# EAGLE design Tiny_Programmer (EAGLE 7.4.0)
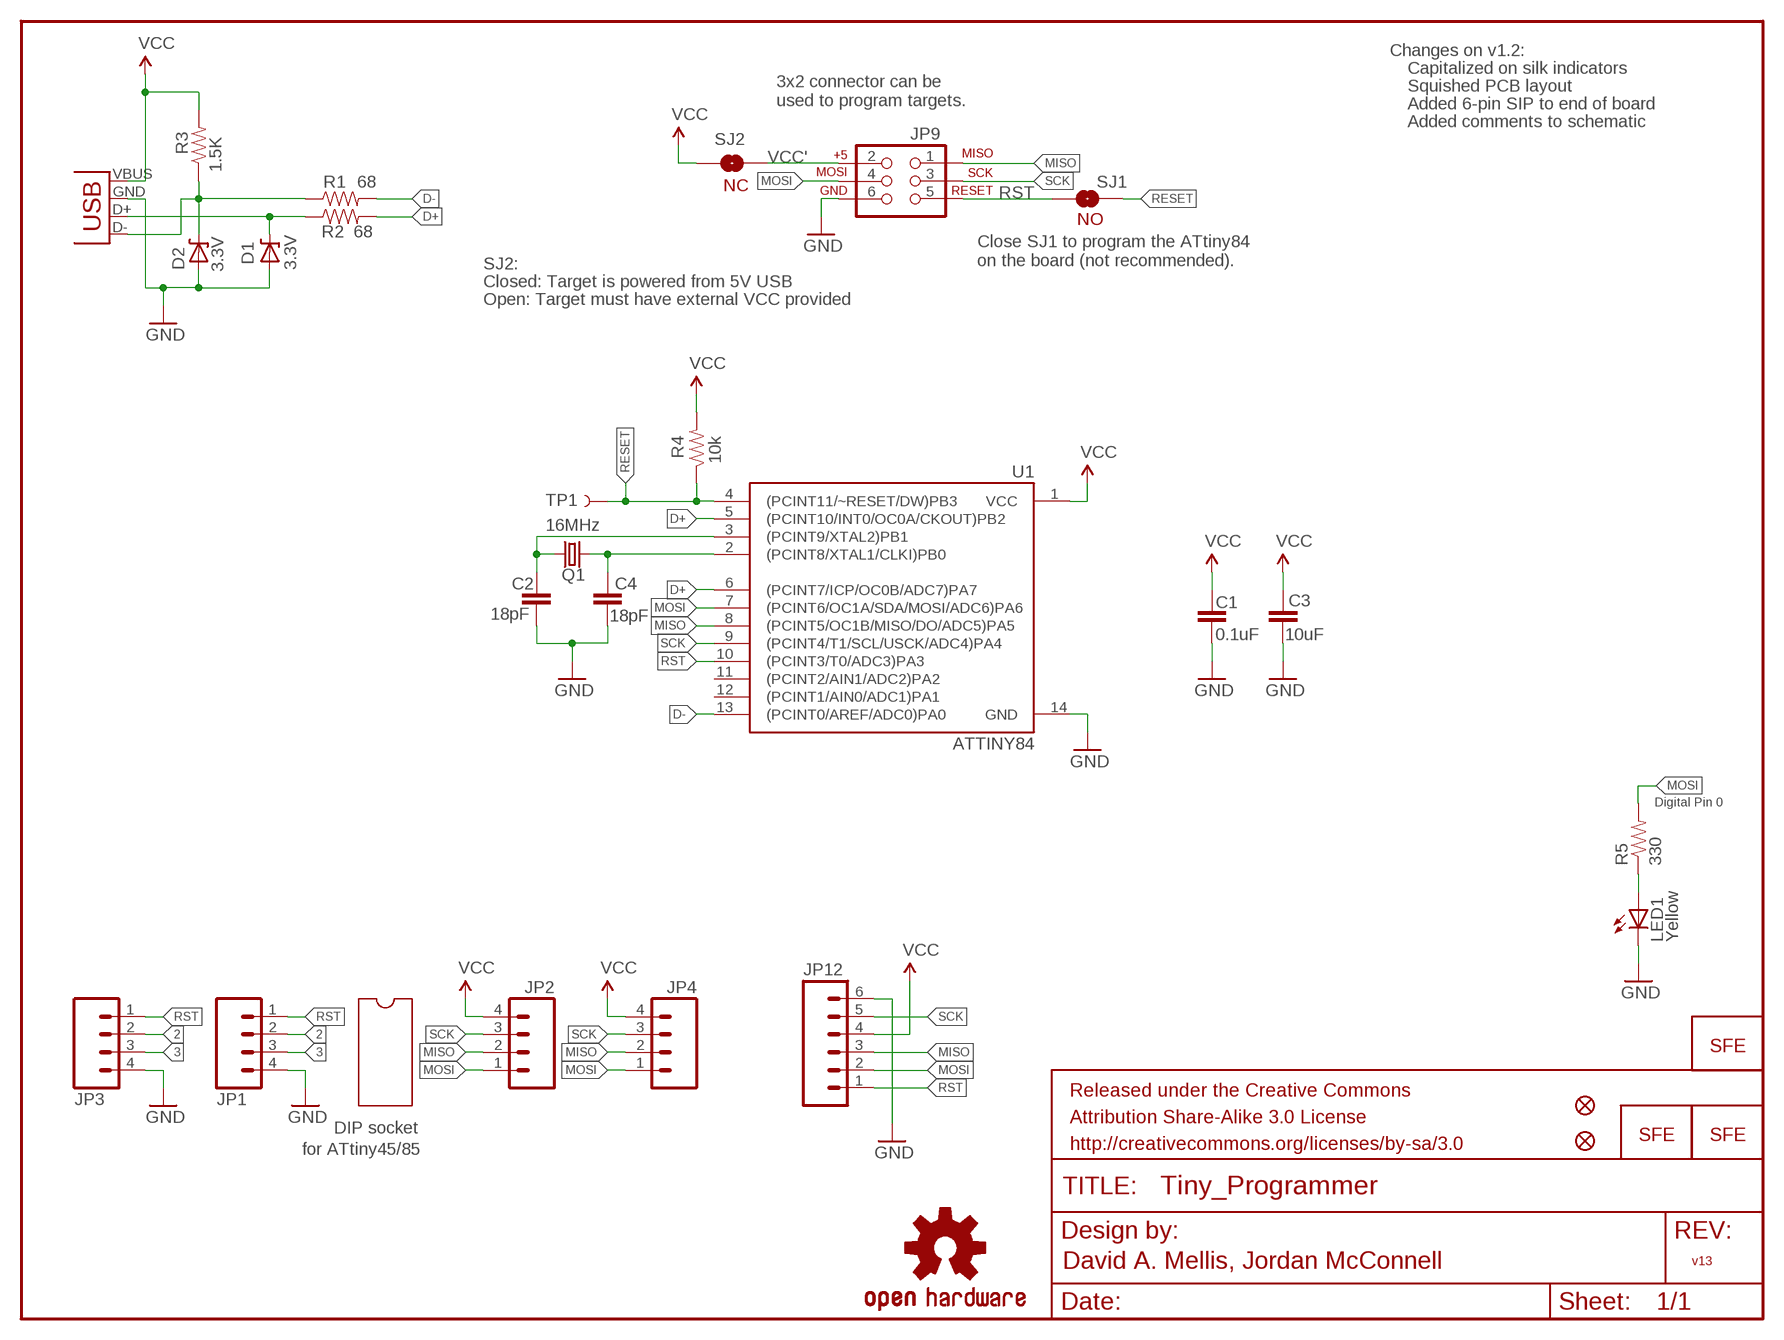
[diagram p0: schematic, sheet 1]

## Parts
C1  0.1uF  CAP0402-CAP  [0402-CAP]
C2  18pF  CAP0402-CAP  [0402-CAP]
C3  10uF  CAP0402-CAP  [0402-CAP]
C4  18pF  CAP0402-CAP  [0402-CAP]
D1  3.3V  DIODE-ZENER-BZT52  [SOD-323]
D2  3.3V  DIODE-ZENER-BZT52  [SOD-323]
FRAME1  FRAME-LETTER  [CREATIVE_COMMONS]
JP1  M04PTH  [1X04]
JP2  M04PTH  [1X04]
JP3  M04SMD_STRAIGHT_COMBO  [1X04_SMD_STRAIGHT_COMBO]
JP4  M04SMD_STRAIGHT_COMBO  [1X04_SMD_STRAIGHT_COMBO]
JP5  LOGO-SFENW2  [SFE-NEW-WEB]
JP6  LOGO-SFESK  [SFE-LOGO-FLAME]
JP7  FIDUCIALUFIDUCIAL  [MICRO-FIDUCIAL]
JP8  FIDUCIALUFIDUCIAL  [MICRO-FIDUCIAL]
JP9  AVR_SPI_PRG_6PTH  [2X3]
JP11  LOGO-SFESK  [SFE-LOGO-FLAME]
JP12  M06SIP  [1X06]
LED1  Yellow  LED0603  [LED-0603]
Q1  16MHz  CRYSTAL5X3  [CRYSTAL-SMD-5X3]
R1  68  RESISTOR0402-RES  [0402-RES]
R2  68  RESISTOR0402-RES  [0402-RES]
R3  1.5K  RESISTOR0402-RES  [0402-RES]
R4  10k  RESISTOR0402-RES  [0402-RES]
R5  330  RESISTOR0402-RES  [0402-RES]
SJ1  SOLDERJUMPERNO  [SJ_2S-NO]
SJ2  NC  SOLDERJUMPERNC  [SJ_2S]
TP1  TEST-POINT3  [PAD.03X.03]
U1  ATTINY84  [SO14]
U$1  OSHW-LOGOS  [OSHW-LOGO-S]
X1  USB-A-H  [USB-A-H]

## Nets
2: JP1.2 JP3.2
3: JP1.3 JP3.3
D+: R2.2 U1.5((PCINT10/INT0/OC0A/CKOUT)PB2) U1.6((PCINT7/ICP/OC0B/ADC7)PA7)
D-: R1.2 U1.13((PCINT0/AREF/ADC0)PA0)
GND: C1.2 C2.2 C3.2 C4.2 D1.2(A) D2.2(A) JP1.4 JP3.4 JP9.6 JP12.6 LED1.C U1.14(GND) X1.GND(VBUS)
MISO: JP2.2 JP4.2 JP9.1 JP12.3 U1.8((PCINT5/OC1B/MISO/DO/ADC5)PA5)
MOSI: JP2.1 JP4.1 JP9.4 JP12.2 R5.2 U1.7((PCINT6/OC1A/SDA/MOSI/ADC6)PA6)
N$1: D2.1(C) R1.1 R3.1 X1.D-(D+)
N$2: D1.1(C) R2.1 X1.D+(D-)
N$3: C2.1 Q1.3 U1.3((PCINT9/XTAL2)PB1)
N$4: C4.1 Q1.1 U1.2((PCINT8/XTAL1/CLKI)PB0)
N$5: LED1.A R5.1
RESET: R4.1 SJ1.1 TP1.P$1 U1.4((PCINT11/~RESET/DW)PB3)
RST: JP1.1 JP3.1 JP9.5 JP12.1 SJ1.2 U1.10((PCINT3/T0/ADC3)PA3)
SCK: JP2.3 JP4.3 JP9.3 JP12.5 U1.9((PCINT4/T1/SCL/USCK/ADC4)PA4)
VCC: C1.1 C3.1 JP2.4 JP4.4 JP12.4 R3.2 R4.2 SJ2.1 U1.1(VCC) X1.VBUS(GND)
VCC': JP9.2 SJ2.2
Unconnected: U1.11((PCINT2/AIN1/ADC2)PA2) U1.12((PCINT1/AIN0/ADC1)PA1)

## Notes on the sheet
- Changes on v1.2:
- Capitalized on silk indicators
- Squished PCB layout
- 3x2 connector can be
  used to program targets.
- Added 6-pin SIP to end of board
- Added comments to schematic
- NC
- NO
- Close SJ1 to program the ATtiny84
  on the board (not recommended).
- SJ2:
- Closed: Target is powered from 5V USB
- Open: Target must have external VCC provided
- Digital Pin 0
- DIP socket
- for ATtiny45/85
- v13
- David A. Mellis, Jordan McConnell

## Library data of the parts
C1-C4 = SparkFun-Passives:CAP: Capacitor Standard 0603 ceramic capacitor, and 0.1" leaded capacitor.
D1 D2 = SparkFun-DiscreteSemi:DIODE-ZENER: Zener Diode Production Part - 8199 3.4V Zener Voltage
FRAME1 = SparkFun-Aesthetics:FRAME-LETTER: Schematic Frame Standard 8.5x11 US Letter frame
JP1-JP4 = SparkFun-Connectors:M04: Header 4 Standard 4-pin 0.1" header. Use with straight break away headers (SKU : PRT-00116), right angle break away headers (PRT-00553), swiss pins (PRT-00743), machine pins (PRT-00117), and female headers (PRT-00115). Molex polarized connector foot print use with SKU : PRT-08231 with associated crimp pins and housings. 1MM SMD Version SKU: PRT-10208
JP5 JP6 JP11 = SparkFun-Aesthetics:LOGO-SFE: Spark Fun Electronics PCB Logo This is the standard Spark Fun Electronics PCB logo.
JP7 JP8 = SparkFun:FIDUCIAL: Fiducial Alignment Points Various fiducial points for machine vision alignment.
JP9 = SparkFun-Connectors:AVR_SPI_PRG_6: AVR ISP 6 Pin This is the reduced ISP connector for AVR programming. Common on Arduino. This footprint will take up less PCB space and can be used with a 10-pin to 6-pin adapter such as SKU: BOB-08508
JP12 = SparkFun-Connectors:M06: Header 6 Standard 6-pin 0.1" header. Use with straight break away headers (SKU : PRT-00116), right angle break away headers (PRT-00553), swiss pins (PRT-00743), machine pins (PRT-00117), and female headers (PRT-00115). Molex polarized connector foot print use with SKU : PRT-08094 with associated crimp pins and housings. NOTES ON THE VARIANTS LOCK and LOCK_LONGPADS... This footprint was designed to help hold the alignment of a through-hole component (i.e. 6-pin header) while soldering it into place. You may notice that each hole has been shifted either up or down by 0.005 of an inch from it's more standard position (which is a perfectly straight line). This slight alteration caused the pins (the squares in the middle) to touch the edges of the holes. Because they are alternating, it causes a "brace" to hold the component in place. 0.005 has proven to be the perfect amount of "off-center" position when using our standard breakaway headers. Although looks a little odd when you look at the bare footprint, once you have a header in there, the alteration is very hard to notice. Also,if you push a header all the way into place, it is covered up entirely on the bottom side. This idea of altering the position of holes to aid alignment will be further integrated into the Sparkfun Library for other footprints. It can help hold any component with 3 or more connection pins.
LED1 = SparkFun-LED:LED: LEDs Standard schematic elements and footprints for 5mm, 3mm, 1206, and 0603 sized LEDs. 5mm - Spark Fun Electronics SKU : COM-00529 (and others)
Q1 = SparkFun-FreqCtrl:CRYSTAL: Various standard crystals. Proven footprints. Spark Fun Electronics SKU : COM-00534
R1-R5 = SparkFun-Passives:RESISTOR: Resistor Basic schematic elements and footprints for 0603, 1206, and PTH resistors.
SJ1 SJ2 = SparkFun-Passives:SOLDERJUMPER: Solder Jumper Standard SMD solder jumper. Used to automate production. Two varients : Normally Open and Normally Closed are the same, but have different paste layers. NC will have a large amount of paste and should jumper during reflow.
TP1 = SparkFun-Passives:TEST-POINT: Bare copper test points for troubleshooting or ICT
U1 = SparkFun-DigitalIC:ATTINY84: Atmel 14-pin 2/4/8kB flash uC
U$1 = SparkFun-Aesthetics:OSHW-LOGO: Open Source Hardware Logo This logo indicates the piece of hardware it is found on incorporates a OSHW license and/or adheres to the definition of open source hardware found here: http://freedomdefined.org/OSHW
X1 = SparkFun-Connectors:USB: USB Connectors USB-B-PTH is fully proven SKU : PRT-00139 USB-miniB is fully proven SKU : PRT-00587 USB-A-PCB is untested. USB-A-H is throughly reviewed, but untested. Spark Fun Electronics SKU : PRT-00437 USB-B-SMT is throughly reviewed, but untested. Needs silkscreen touching up. USB-A-S has not been used/tested USB-MB-H has not been used/tested

## Board
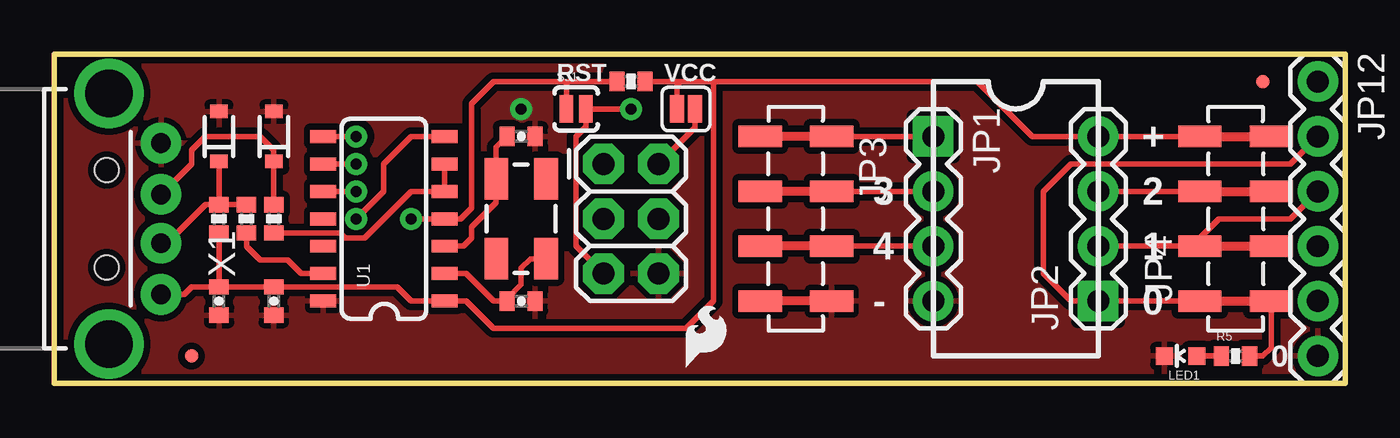
[diagram p1: board, top side]
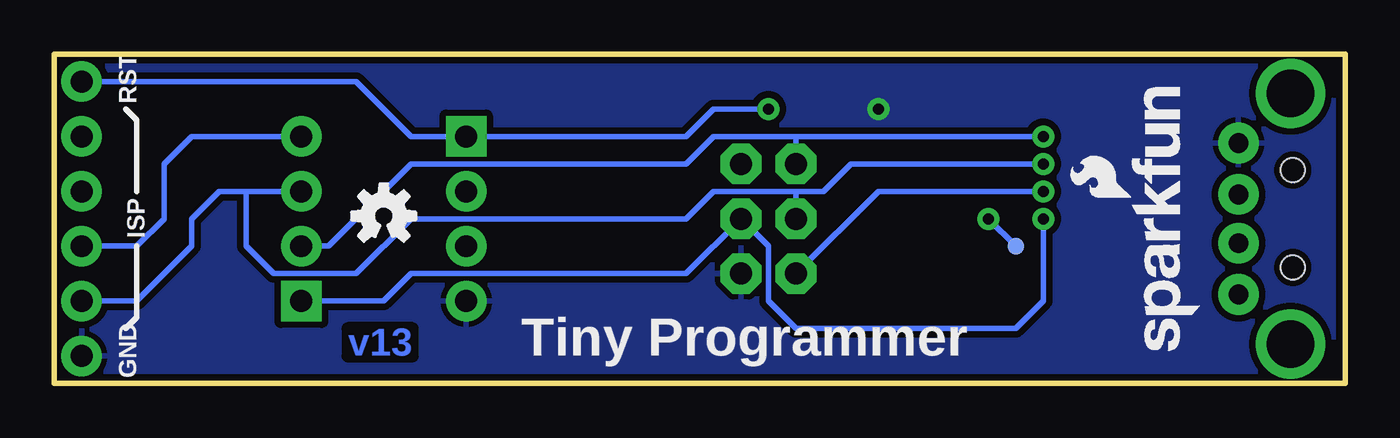
[diagram p2: board, bottom side, seen from below]

Size 59.69 x 15.24 mm. Coordinates in mm from the lower left corner, seen from the top.
Outline: 0,0 59.69,0 59.69,15.24 0,15.24 0,0
Copper layers (1*16): Top 0.035mm / dielectric 1.5mm / Bottom 0.035mm
Design rules "default": minimum track width 8mil, minimum drill 20mil, track to track 8mil, track to pad 8mil, pad to pad 8mil, via to via 8mil, smd to smd 8mil, copper to edge 8mil, drill to drill 8mil, minimum pad ring 12mil, minimum via ring 10mil, stop-mask expansion 4mil, vias tented up to drill 20mil, thermal gap 10mil

### Footprints (pad centres in the part's own frame; a part is rotated, then mirrored left to right if it is on the bottom)
0402-CAP = smd 0.7 x 0.9: 1 -0.65,0; 2 0.65,0
SOD-323 = smd 0.63 x 0.83: 1 -1.15,0; 2 1.15,0
1X04 = drill 1.016 pad 1.88 square: 1 0,0 | drill 1.016 pad 1.88: 2 2.54,0; 3 5.08,0; 4 7.62,0
1X04_SMD_STRAIGHT_COMBO = smd 1 x 2: 1 0,-1.65; 1-2 0,1.65; 2 2.54,1.65; 2-2 2.54,-1.65; 3 5.08,-1.65; 3-2 5.08,1.65; 4 7.62,1.65; 4-2 7.62,-1.65
MICRO-FIDUCIAL = smd 0.635 x 0.635: 1 0,0
2X3 = drill 1.016 pad 1.88 octagon: 1 0,0; 2 0,2.54; 3 2.54,0; 4 2.54,2.54; 5 5.08,0; 6 5.08,2.54
1X06 = drill 1.016 pad 1.88: 1 0,0; 2 2.54,0; 3 5.08,0; 4 7.62,0; 5 10.16,0; 6 12.7,0
LED-0603 = smd 0.8 x 0.8: A 0,-0.75; C 0,0.75
CRYSTAL-SMD-5X3 = smd 1.9 x 1.1: 1 -1.85,-1.15; 2 1.85,-1.15; 3 1.85,1.15; 4 -1.85,1.15
0402-RES = smd 0.7 x 0.9: 1 -0.65,0; 2 0.65,0
SJ_2S-NO = smd 0.635 x 1.27: 1 -0.45,0; 2 0.45,0
SJ_2S = smd 0.635 x 1.27: 1 -0.412,0; 2 0.412,0
PAD.03X.03 = smd 0.762 x 0.762: P$1 0,0
SO14 = smd 0.6 x 1.2: 1 -3.81,-2.8; 2 -2.54,-2.8; 3 -1.27,-2.8; 4 0,-2.8; 5 1.27,-2.8; 6 2.54,-2.8; 7 3.81,-2.8; 8 3.81,2.8; 9 2.54,2.8; 10 1.27,2.8; 11 0,2.8; 12 -1.27,2.8; 13 -2.54,2.8; 14 -3.81,2.8
USB-A-H = drill 0.914 pad 1.88: D+ 2.4,1.127; D- 2.4,-1.127; GND 2.4,3.5; VBUS 2.4,-3.5 | drill 2.2: GND2 0,-5.8; GND3 0,5.8 | hole 1.1: -0.1,2.25; -0.1,-2.25

### Placement (x,y rotation side)
C1  7.62,3.81 270 top
C2  21.59,11.43 0 top
C3  10.16,3.81 270 top
C4  21.59,3.81 0 top
D1  10.16,11.43 90 top
D2  7.62,11.43 90 top
FRAME1  6.35,-10.16 0 top  (outside the outline)
JP1  40.64,11.43 270 top
JP2  48.26,3.81 90 top
JP3  34.29,11.43 270 top
JP4  54.61,3.81 90 top
JP5  6.73,1.52 90 bottom
JP6  29.21,0.76 0 top
JP7  6.35,1.27 0 top
JP8  55.88,13.97 0 top
JP9  25.4,10.16 270 top
JP11  9.91,8.64 90 bottom
JP12  58.42,13.97 270 top
LED1  52.07,1.27 90 top
Q1  21.59,7.62 90 top
R1  8.89,7.62 270 top
R2  10.16,7.62 270 top
R3  7.62,7.62 270 top
R4  26.67,13.97 0 top
R5  54.61,1.27 0 top
SJ1  24.13,12.7 0 top
SJ2  29.21,12.7 0 top
TP1  15.24,6.35 0 bottom
U1  15.24,7.62 90 top
U$1  44.45,7.75 0 bottom
X1  2.54,7.62 0 top

### Tracks (layer width: path | path; a pad name or v marks a point on that pad's centre or on a via)
2
  Top 0.254: JP1.2 JP3.2
3
  Top 0.254: JP1.3 JP3.3
D+
  Top 0.254: U1.6 U1.5 16.51,8.89 14.35,6.73 13.46,6.73 13.22,6.97 R2.2
D-
  Top 0.254: R1.2 8.9,6.97 8.9,6.33 9.53,5.71 10.79,5.71 11.43,5.08 U1.13
GND  (via drill 0.51)
  other vias: 21.59,12.7
  pour Bottom (isolate 0.305): 0,0 0,15.24 59.69,15.24 59.69,0
  pour Top (isolate 0.305): 0,0 0,15.24 59.69,15.24 59.69,0
MISO  (via drill 0.51)
  Top 0.254: JP2.2 JP4.2 52.96,6.73 53.85,7.62 57.15,7.62 JP12.3 | U1.8 v13.97,11.43
  Bottom 0.254: v13.97,11.43 25.4,11.43 | 25.4,11.43 29.21,11.43 30.48,10.16 43.18,10.16 46.99,6.35 JP2.2 | JP9.1 25.4,11.43
MOSI  (via drill 0.51)
  Top 0.254: JP4.1 JP2.1 46.99,3.81 45.72,5.08 45.72,8.89 46.99,10.16 57.15,10.16 JP12.2 | R5.2 55.88,1.27 56.26,1.65 JP4.1 | U1.7 16.51,11.43 15.24,10.16 15.24,8.89 v13.97,7.62 | JP4.1 56.26,4.19
  Bottom 0.254: v13.97,7.62 13.97,3.81 15.24,2.54 25.4,2.54 26.67,3.81 26.67,6.35 JP9.4 30.48,5.08 43.18,5.08 44.45,3.81 JP2.1
N$1
  Top 0.254: R3.1 R1.1 | D2.1 R3.1 | R3.1 7,8.27 5.22,6.49 X1.D-
N$2
  Top 0.254: X1.D+ 6.35,10.16 6.35,10.79 6.99,11.43 9.53,11.43 10.16,10.79 D1.1 R2.1
N$3
  Top 0.254: U1.3 18.92,6.35 19.3,6.73 19.3,7.24 20.44,8.38 Q1.3 20.44,10.93 C2.1
N$4
  Top 0.254: U1.2 19.05,5.08 20.32,3.81 C4.1 20.94,3.92 21.59,4.57 21.59,5.33 22.03,5.77 Q1.1
N$5
  Top 0.254: R5.1 LED1.A
RESET  (via drill 0.51)
  Top 0.254: v16.51,7.62 U1.4 18.8,7.62 19.3,8.13 19.3,12.95 20.32,13.97 23.62,13.97 | SJ1.1 23.68,13.91 23.62,13.97 | 23.62,13.97 R4.1
  Bottom 0.254: v16.51,7.62 TP1.P$1
RST  (via drill 0.51)
  Top 0.254: U1.10 v13.97,8.89 | JP3.1 JP1.1 | JP9.5 24.13,6.35 24.13,11.43 24.58,11.88 SJ1.2 v26.67,12.7
  Bottom 0.254: v13.97,8.89 21.59,8.89 JP9.5 | v26.67,12.7 29.21,12.7 30.48,11.43 JP1.1 43.18,11.43 45.72,13.97 JP12.1
SCK  (via drill 0.51)
  Top 0.254: v13.97,10.16 U1.9 | JP4.3 JP2.3
  Bottom 0.254: v13.97,10.16 22.86,10.16 24.13,8.89 25.4,8.89 | 25.4,8.89 29.21,8.89 30.48,7.62 43.18,7.62 45.72,5.08 49.53,5.08 50.8,6.35 50.8,8.89 | JP9.3 25.4,8.89 | JP12.5 55.88,3.81 53.34,6.35 53.34,7.62 52.07,8.89 50.8,8.89 | 50.8,8.89 JP2.3
VCC
  Top 0.254: JP4.4 JP2.4 45.21,11.43 42.67,13.97 30.48,13.97 | R3.2 C1.1 | C1.1 C3.1 15.86,4.46 16.51,3.81 U1.1 19.05,3.81 20.32,2.54 29.21,2.54 30.48,3.81 30.48,13.97 | SJ2.1 28.8,13.81 28.96,13.97 | R4.2 28.96,13.97 | 28.96,13.97 30.48,13.97 | X1.VBUS 6.03,4.12 6.37,4.46 C1.1
  Bottom 0.254: JP12.4 55.88,6.35 54.61,7.62 54.61,10.16 53.34,11.43 JP2.4
VCC'
  Top 0.254: SJ2.2 29.62,11.84 JP9.2

### Text on the board
Bottom: v13
tPlace: RST | VCC | + | 3 | 2 | 4 | 1 | - | 0 | 0
bPlace: RST | ISP | Tiny Programmer | GND
tNames: MIT Media Lab | High-Low Tech | hlt.media.mit.edu
tValues: David A. Mellis, Jordan McConnell